# Altium schematic sheet Sender.SchDoc
size A4; SheetNumber: 2; SheetTotal: 2
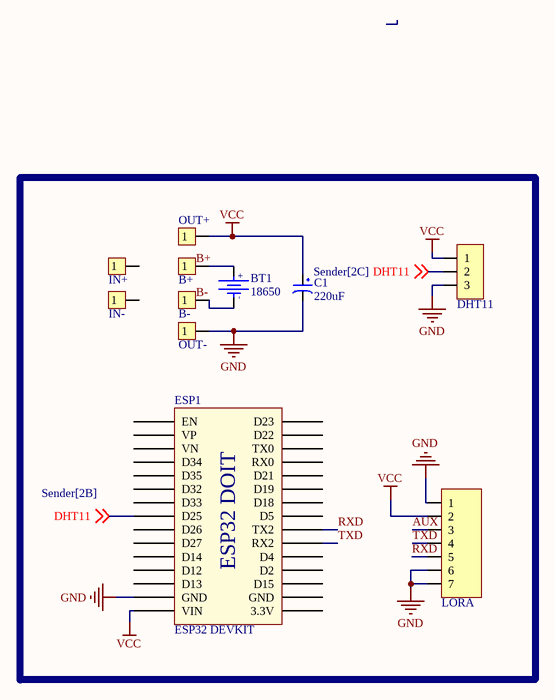
[diagram p0: Sender.SchDoc]

## Parts
BT1  18650  [De Pin18650]
C1  220uF  [Tu hoa 8mm]
ESP1  ESP32 DEVKIT  [ESP32 WROOM 32 KIT]
JP1  OUT+  [JP 1x1 DT]
JP2  LORA  [JP 1x7 CT]
JP3  IN+  [JP 1x1 DT]
JP4  B+  [JP 1x1 DT]
JP5  IN-  [JP 1x1 DT]
JP6  B-  [JP 1x1 DT]
JP7  OUT-  [JP 1x1 DT]
JP8  DHT11  [JP 1x3 CT]

## Nets
GND: C1.2 ESP1.14(GND) JP2.1 JP2.6 JP2.7 JP7.1 JP8.3
VCC: C1.1 ESP1.15(VIN) JP1.1 JP2.2 JP8.1
AUX: JP2.3
DHT11: ESP1.8(D25) JP8.2 ; off-sheet DHT11
RXD: ESP1.22(TX2) JP2.5
TXD: ESP1.21(RX2) JP2.4
NetBT1_1: BT1.1(VCC) JP4.1
NetBT1_2: BT1.2(GND) JP6.1

Not connected (* = marked no-connect by the designer): ESP1 1(EN) 2(VP) 3(VN) 4(D34) 5(D35) 6(D32) 7(D33) 9(D26) 10(D27) 11(D14) 12(D12) 13(D13) 16(3.3V) 17(GND) 18(D15) 19(D2) 20(D4) 23(D5) 24(D18) 25(D19) 26(D21) 27(RX0) 28(TX0) 29(D22) 30(D23); JP3 1; JP5 1

## Notes on the sheet
- Labels drawn without touching a wire or pin: B+, B-
- (in symbol De Pin18650) +; -
- (in symbol ESP32 WROOM 32 KIT) ESP32 DOIT

## Library data of the parts
BT1 = De Pin18650
C1 = Tu Hoa 220uF 25V 8x10: Cắm; Don_Vi: Con; So_Chan: 2; Ten_Linh_Kien: Tụ Hóa 220uF 25V 8x10MM; Ma_Hang: MH006864; Chung_Loai: Cắm; Kieu_Chan: *
ESP1 = ESP32 WROOM 32 KIT
JP1 JP3-JP7 = JP 1x1 2.54 Duc Thang: Cắm; Ten_Linh_Kien: Jump Đơn Đực 2.54MM 1x40P Thẳng 11MM; Don_Vi: Con; Ma_Hang: MH000903; Ghi_Chu: *; Kieu_Chan: *; Chung_Loai: Cắm
JP2 = JP 1x7 2.54 Cai Thang: Cắm; Ten_Linh_Kien: Jump Đơn Cái 2.54MM 1x20P Thẳng; Don_Vi: Con; Ma_Hang: MH004006; Ghi_Chu: *; Kieu_Chan: *; Chung_Loai: Cắm
JP8 = JP 1x3 2.54 Cai Thang: Cắm; Ten_Linh_Kien: Jump Đơn Cái 2.54MM 1x20P Thẳng; Don_Vi: Con; Ma_Hang: MH004006; Ghi_Chu: *; Kieu_Chan: *; Chung_Loai: Cắm